# Altium schematic sheet MB_ANALOG.SchDoc
size A4
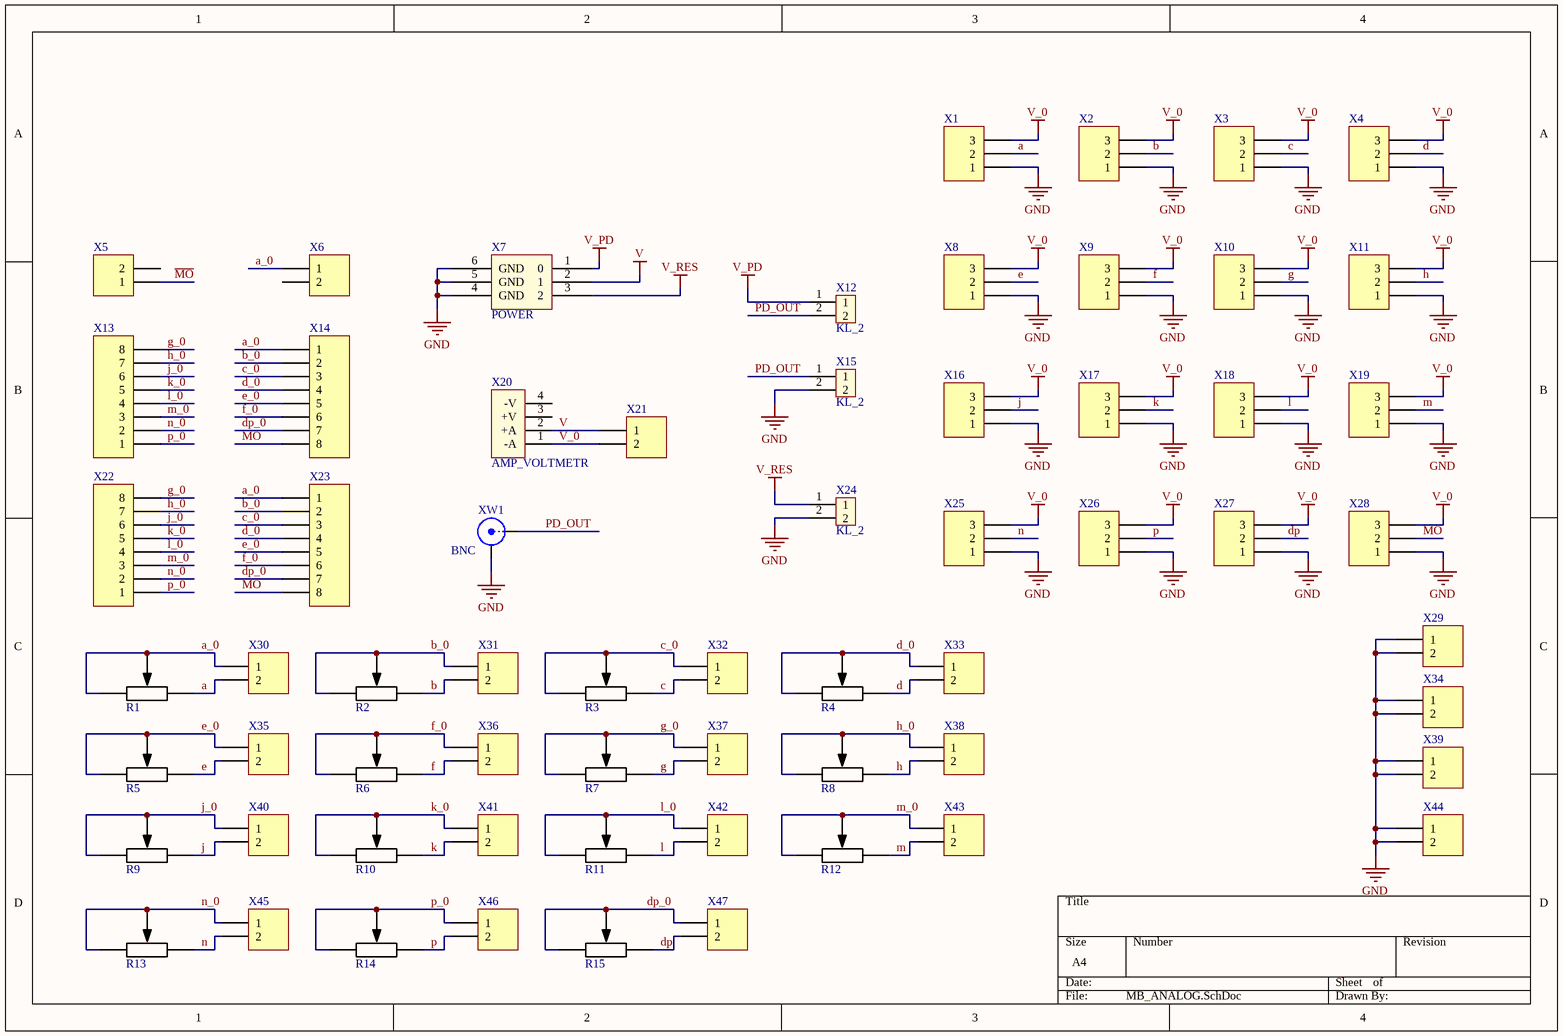
[diagram p0: MB_ANALOG.SchDoc]

## Parts
R1  RES 3266W  [RES 3266W]  (value not drawn)
R2  RES 3266W  [RES 3266W]  (value not drawn)
R3  RES 3266W  [RES 3266W]  (value not drawn)
R4  RES 3266W  [RES 3266W]  (value not drawn)
R5  RES 3266W  [RES 3266W]  (value not drawn)
R6  RES 3266W  [RES 3266W]  (value not drawn)
R7  RES 3266W  [RES 3266W]  (value not drawn)
R8  RES 3266W  [RES 3266W]  (value not drawn)
R9  RES 3266W  [RES 3266W]  (value not drawn)
R10  RES 3266W  [RES 3266W]  (value not drawn)
R11  RES 3266W  [RES 3266W]  (value not drawn)
R12  RES 3266W  [RES 3266W]  (value not drawn)
R13  RES 3266W  [RES 3266W]  (value not drawn)
R14  RES 3266W  [RES 3266W]  (value not drawn)
R15  RES 3266W  [RES 3266W]  (value not drawn)
X1  Header 3  [HDR1X3]  (value not drawn)
X2  Header 3  [HDR1X3]  (value not drawn)
X3  Header 3  [HDR1X3]  (value not drawn)
X4  Header 3  [HDR1X3]  (value not drawn)
X5  Header 2  [HDR1X2]  (value not drawn)
X6  Header 2  [HDR1X2]  (value not drawn)
X7  POWER  [POWER]
X8  Header 3  [HDR1X3]  (value not drawn)
X9  Header 3  [HDR1X3]  (value not drawn)
X10  Header 3  [HDR1X3]  (value not drawn)
X11  Header 3  [HDR1X3]  (value not drawn)
X12  KL_2  [KLEMMNIK_2]
X13  Header 8  [HDR1X8]  (value not drawn)
X14  Header 8  [HDR1X8]  (value not drawn)
X15  KL_2  [KLEMMNIK_2]
X16  Header 3  [HDR1X3]  (value not drawn)
X17  Header 3  [HDR1X3]  (value not drawn)
X18  Header 3  [HDR1X3]  (value not drawn)
X19  Header 3  [HDR1X3]  (value not drawn)
X20  AMP_VOLTMETR  [AMP_VOLTMETR]
X21  Header 2  [HDR1X2]  (value not drawn)
X22  Header 8  [HDR1X8]  (value not drawn)
X23  Header 8  [HDR1X8]  (value not drawn)
X24  KL_2  [KLEMMNIK_2]
X25  Header 3  [HDR1X3]  (value not drawn)
X26  Header 3  [HDR1X3]  (value not drawn)
X27  Header 3  [HDR1X3]  (value not drawn)
X28  Header 3  [HDR1X3]  (value not drawn)
X29  Header 2  [HDR1X2]  (value not drawn)
X30  Header 2  [HDR1X2]  (value not drawn)
X31  Header 2  [HDR1X2]  (value not drawn)
X32  Header 2  [HDR1X2]  (value not drawn)
X33  Header 2  [HDR1X2]  (value not drawn)
X34  Header 2  [HDR1X2]  (value not drawn)
X35  Header 2  [HDR1X2]  (value not drawn)
X36  Header 2  [HDR1X2]  (value not drawn)
X37  Header 2  [HDR1X2]  (value not drawn)
X38  Header 2  [HDR1X2]  (value not drawn)
X39  Header 2  [HDR1X2]  (value not drawn)
X40  Header 2  [HDR1X2]  (value not drawn)
X41  Header 2  [HDR1X2]  (value not drawn)
X42  Header 2  [HDR1X2]  (value not drawn)
X43  Header 2  [HDR1X2]  (value not drawn)
X44  Header 2  [HDR1X2]  (value not drawn)
X45  Header 2  [HDR1X2]  (value not drawn)
X46  Header 2  [HDR1X2]  (value not drawn)
X47  Header 2  [HDR1X2]  (value not drawn)
XW1  BNC  [BNC_RA CON]

## Nets
GND: X1.1 X2.1 X3.1 X4.1 X7.4(GND) X7.5(GND) X7.6(GND) X8.1 X9.1 X10.1 X11.1 X15.2 X16.1 X17.1 X18.1 X19.1 X24.2 X25.1 X26.1 X27.1 X28.1 X29.1 X29.2 X34.1 X34.2 X39.1 X39.2 X44.1 X44.2 XW1.2(Y)
V: X7.2(1) X20.2(+A) X21.1
V_0: X1.3 X2.3 X3.3 X4.3 X8.3 X9.3 X10.3 X11.3 X16.3 X17.3 X18.3 X19.3 X20.1(-A) X21.2 X25.3 X26.3 X27.3 X28.3
V_PD: X7.1(0) X12.1
V_RES: X7.3(2) X24.1
a: R1.3 X1.2 X30.2
a_0: R1.1 R1.2 X6.1 X14.1 X23.1 X30.1
b: R2.3 X2.2 X31.2
b_0: R2.1 R2.2 X14.2 X23.2 X31.1
c: R3.3 X3.2 X32.2
c_0: R3.1 R3.2 X14.3 X23.3 X32.1
d: R4.3 X4.2 X33.2
d_0: R4.1 R4.2 X14.4 X23.4 X33.1
dp: R15.3 X27.2 X47.2
dp_0: R15.1 R15.2 X14.7 X23.7 X47.1
e: R5.3 X8.2 X35.2
e_0: R5.1 R5.2 X14.5 X23.5 X35.1
f: R6.3 X9.2 X36.2
f_0: R6.1 R6.2 X14.6 X23.6 X36.1
g: R7.3 X10.2 X37.2
g_0: R7.1 R7.2 X13.8 X22.8 X37.1
h: R8.3 X11.2 X38.2
h_0: R8.1 R8.2 X13.7 X22.7 X38.1
j: R9.3 X16.2 X40.2
j_0: R9.1 R9.2 X13.6 X22.6 X40.1
k: R10.3 X17.2 X41.2
k_0: R10.1 R10.2 X13.5 X22.5 X41.1
l: R11.3 X18.2 X42.2
l_0: R11.1 R11.2 X13.4 X22.4 X42.1
m: R12.3 X19.2 X43.2
~{MO}: X5.1 X14.8 X23.8 X28.2
m_0: R12.1 R12.2 X13.3 X22.3 X43.1
n: R13.3 X25.2 X45.2
n_0: R13.1 R13.2 X13.2 X22.2 X45.1
p: R14.3 X26.2 X46.2
p_0: R14.1 R14.2 X13.1 X22.1 X46.1
PD_OUT: X12.2 X15.1 XW1.1(X)

Not connected (* = marked no-connect by the designer): X5 2; X6 2; X20 3(+V) 4(-V)

## Library data of the parts
X1-X4 X8-X11 X16-X19 X25-X28 = Header 3: Header, 3-Pin; LatestRevisionDate: 17-Jul-2002; LatestRevisionNote: Re-released for DXP Platform.; Publisher: Altium Limited
X5 X6 X21 X29-X47 = Header 2: Header, 2-Pin; LatestRevisionDate: 17-Jul-2002; LatestRevisionNote: Re-released for DXP Platform.; Publisher: Altium Limited
X12 X15 X24 = KLEMMNIK_2
X13 X14 X22 X23 = Header 8: Header, 8-Pin; LatestRevisionDate: 17-Jul-2002; LatestRevisionNote: Re-released for DXP Platform.; Publisher: Altium Limited
XW1 = BNC: BNC Elbow Connector; LatestRevisionDate: 17-Jul-2002; LatestRevisionNote: Re-released for DXP Platform.; Publisher: Altium Limited